# EAGLE design LeguinoNano (EAGLE 8.5.0)
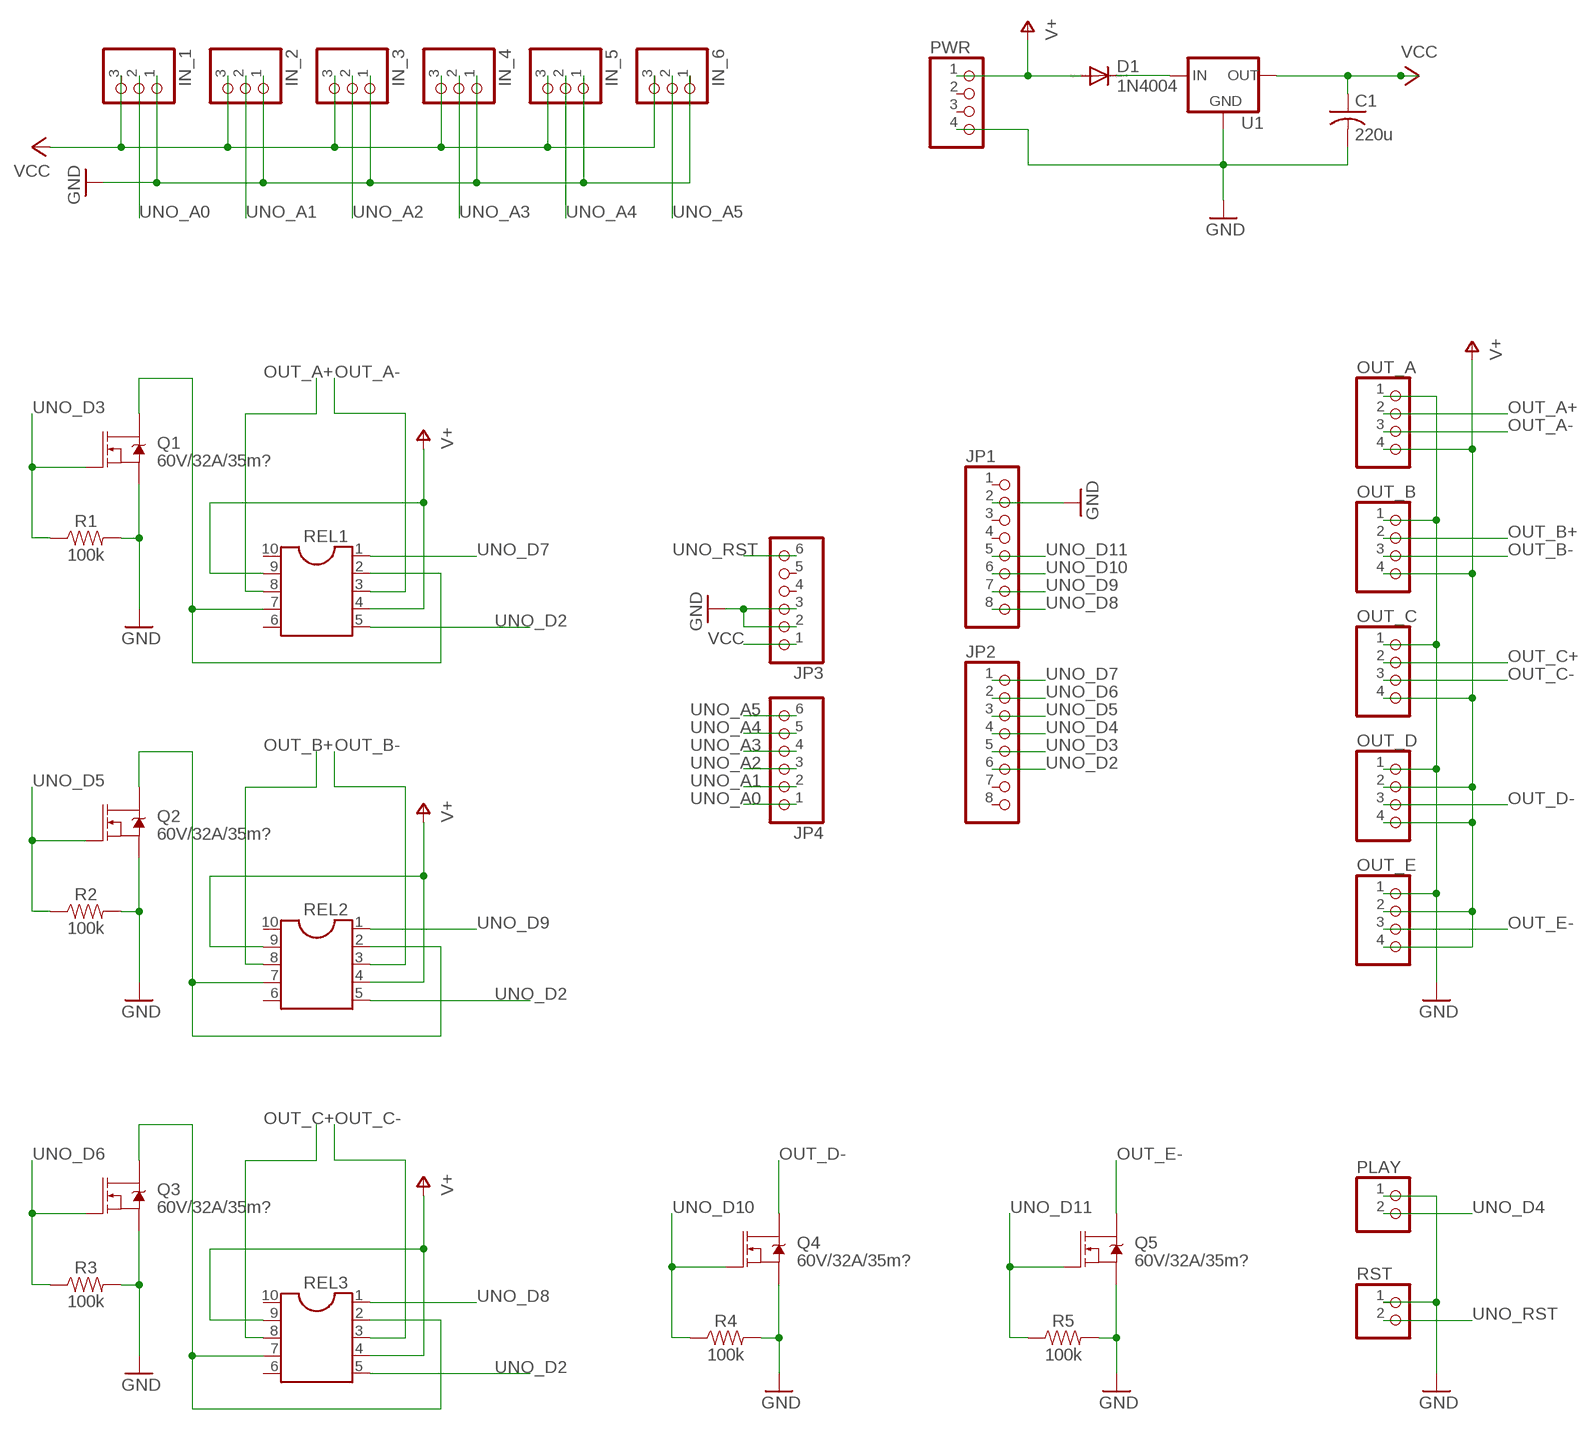
[diagram p0: schematic, sheet 1]

## Parts
C1  220u  C-US050-030X075  [C050-030X075]
D1  1N4004  [DO41-10]
IN_1  PINHD-1X3  [1X03]
IN_2  PINHD-1X3  [1X03]
IN_3  PINHD-1X3  [1X03]
IN_4  PINHD-1X3  [1X03]
IN_5  PINHD-1X3  [1X03]
IN_6  PINHD-1X3  [1X03]
JP1  PINHD-1X8  [1X08]
JP2  PINHD-1X8  [1X08]
JP3  PINHD-1X6  [1X06]
JP4  PINHD-1X6  [1X06]
OUT_A  PINHD-1X4  [1X04]
OUT_B  PINHD-1X4  [1X04]
OUT_C  PINHD-1X4  [1X04]
OUT_D  PINHD-1X4  [1X04]
OUT_E  PINHD-1X4  [1X04]
PLAY  PINHD-1X2  [1X02]
PWR  PINHD-1X4  [1X04]
Q1  60V/32A/35m?  MOSFET-NCH-FQP30N06L  [TO220V]
Q2  60V/32A/35m?  MOSFET-NCH-FQP30N06L  [TO220V]
Q3  60V/32A/35m?  MOSFET-NCH-FQP30N06L  [TO220V]
Q4  60V/32A/35m?  MOSFET-NCH-FQP30N06L  [TO220V]
Q5  60V/32A/35m?  MOSFET-NCH-FQP30N06L  [TO220V]
R1  100k  100KOHM-HORIZ-1/4W-1%  [AXIAL-0.3]
R2  100k  100KOHM-HORIZ-1/4W-1%  [AXIAL-0.3]
R3  100k  100KOHM-HORIZ-1/4W-1%  [AXIAL-0.3]
R4  100k  100KOHM-HORIZ-1/4W-1%  [AXIAL-0.3]
R5  100k  100KOHM-HORIZ-1/4W-1%  [AXIAL-0.3]
REL1  DIL10  [DIL10]
REL2  DIL10  [DIL10]
REL3  DIL10  [DIL10]
RST  PINHD-1X2  [1X02]
U1  V_REG_78XX-TO-220  [TO-220-ALT]

## Nets
GND [supply]: C1.2 IN_1.1 IN_2.1 IN_3.1 IN_4.1 IN_5.1 IN_6.1 JP1.2 JP3.2 JP3.3 OUT_A.1 OUT_B.1 OUT_C.1 OUT_D.1 OUT_E.1 PLAY.1 PWR.4 Q1.3(S) Q2.3(S) Q3.3(S) Q4.3(S) Q5.3(S) R1.P$2 R2.P$2 R3.P$2 R4.P$2 R5.P$2 RST.1 U1.GND
N$1: D1.C U1.IN
N$4 [supply]: Q1.2(D) REL1.2 REL1.7
N$13 [supply]: Q2.2(D) REL2.2 REL2.7
N$19 [supply]: Q3.2(D) REL3.2 REL3.7
OUT_A+ [supply]: OUT_A.2 REL1.8
OUT_A- [supply]: OUT_A.3 REL1.3
OUT_B+ [supply]: OUT_B.2 REL2.8
OUT_B- [supply]: OUT_B.3 REL2.3
OUT_C+ [supply]: OUT_C.2 REL3.8
OUT_C- [supply]: OUT_C.3 REL3.3
OUT_D- [supply]: OUT_D.3 Q4.2(D)
OUT_E- [supply]: OUT_E.3 Q5.2(D)
UNO_A0: IN_1.2 JP4.1
UNO_A1: IN_2.2 JP4.2
UNO_A2: IN_3.2 JP4.3
UNO_A3: IN_4.2 JP4.4
UNO_A4: IN_5.2 JP4.5
UNO_A5: IN_6.2 JP4.6
UNO_D2: JP2.6 REL1.5 REL2.5 REL3.5
UNO_D3: JP2.5 Q1.1(G) R1.P$1
UNO_D4: JP2.4 PLAY.2
UNO_D5: JP2.3 Q2.1(G) R2.P$1
UNO_D6: JP2.2 Q3.1(G) R3.P$1
UNO_D7: JP2.1 REL1.1
UNO_D8: JP1.8 REL3.1
UNO_D9: JP1.7 REL2.1
UNO_D10: JP1.6 Q4.1(G) R4.P$1
UNO_D11: JP1.5 Q5.1(G) R5.P$1
UNO_RST: JP3.6 RST.2
V+ [supply]: D1.A OUT_A.4 OUT_B.4 OUT_C.4 OUT_D.2 OUT_D.4 OUT_E.2 OUT_E.4 PWR.1 REL1.4 REL1.9 REL2.4 REL2.9 REL3.4 REL3.9
VCC: C1.1 IN_1.3 IN_2.3 IN_3.3 IN_4.3 IN_5.3 IN_6.3 JP3.1 U1.OUT
Unconnected: JP1.1 JP1.3 JP1.4 JP2.7 JP2.8 JP3.4 JP3.5 PWR.2 PWR.3 REL1.6 REL1.10 REL2.6 REL2.10 REL3.6 REL3.10

## Library data of the parts
C1 = adafruit:C-US: CAPACITOR, American symbol
D1 = diode:1N4004: DIODE general purpose rectifier, 1 A
IN_1-IN_6 = pinhead:PINHD-1X3: PIN HEADER
JP1 JP2 = pinhead:PINHD-1X8: PIN HEADER
JP3 JP4 = pinhead:PINHD-1X6: PIN HEADER
OUT_A OUT_B OUT_C OUT_D OUT_E PWR = pinhead:PINHD-1X4: PIN HEADER
PLAY RST = pinhead:PINHD-1X2: PIN HEADER
Q1-Q5 = SparkFun-DiscreteSemi:MOSFET-NCH: N-channel MOSFETs Voltage controlled devices that allow control of high current outputs. SparkFun Products: SparkFun OpenScale <https://www.sparkfun.com/products/13261> SparkFun Digital Sandbox <https://www.sparkfun.com/products/12651> SparkFun Monster Moto Shield <https://www.sparkfun.com/products/10182> SparkFun MOSFET Power Controller <https://www.sparkfun.com/products/11214>; PROD_ID: TRANS-10060
R1-R5 = SparkFun-Resistors:100KOHM: 100k? resistor A resistor is a passive two-terminal electrical component that implements electrical resistance as a circuit element. Resistors act to reduce current flow, and, at the same time, act to lower voltage levels within circuits. - Wikipedia; PROD_ID: RES-12184
REL1-REL3 = ic-package:DIL10: Dual In Line / Socket
U1 = SparkFun-IC-Power:V_REG_78XX: Voltage Regulator Standard 78xx regulator. IGO (Input Ground Output). Spark Fun Electronics SKU : COM-00107; PROD_ID: VREG-08450; SF_ID: COM-00107

## Net classes
0 default: width 0.254 mm, drill 0.254 mm, clearance 0.254 mm
1 supply: width 1.016 mm, drill 1.016 mm, clearance 0.254 mm

## Board
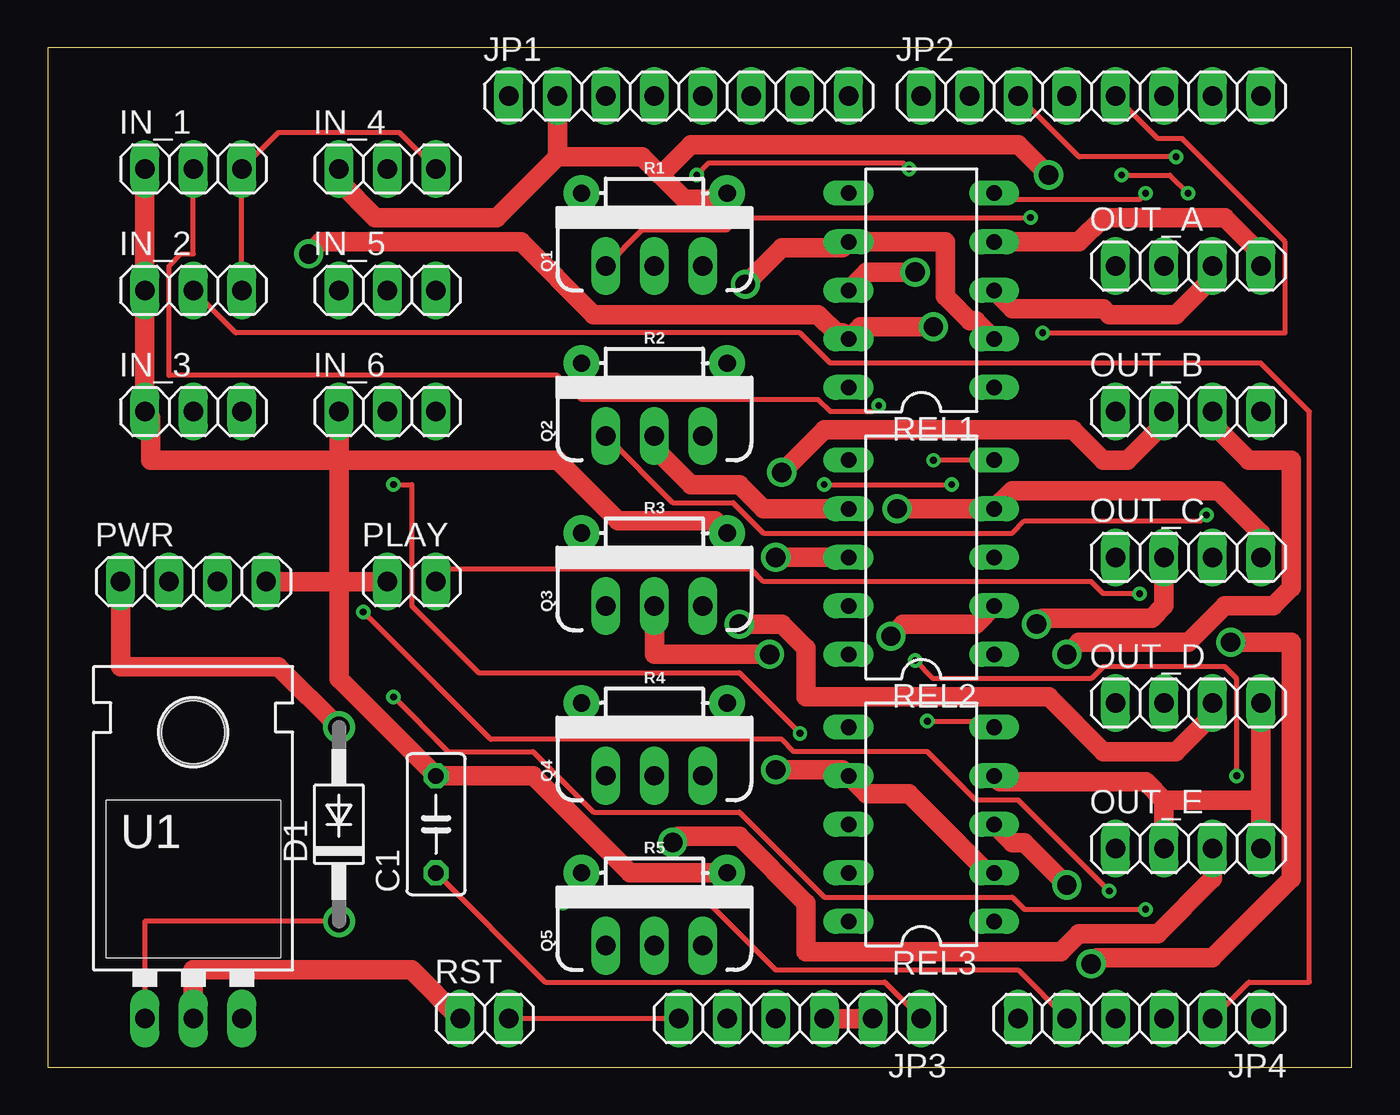
[diagram p1: board, top side]
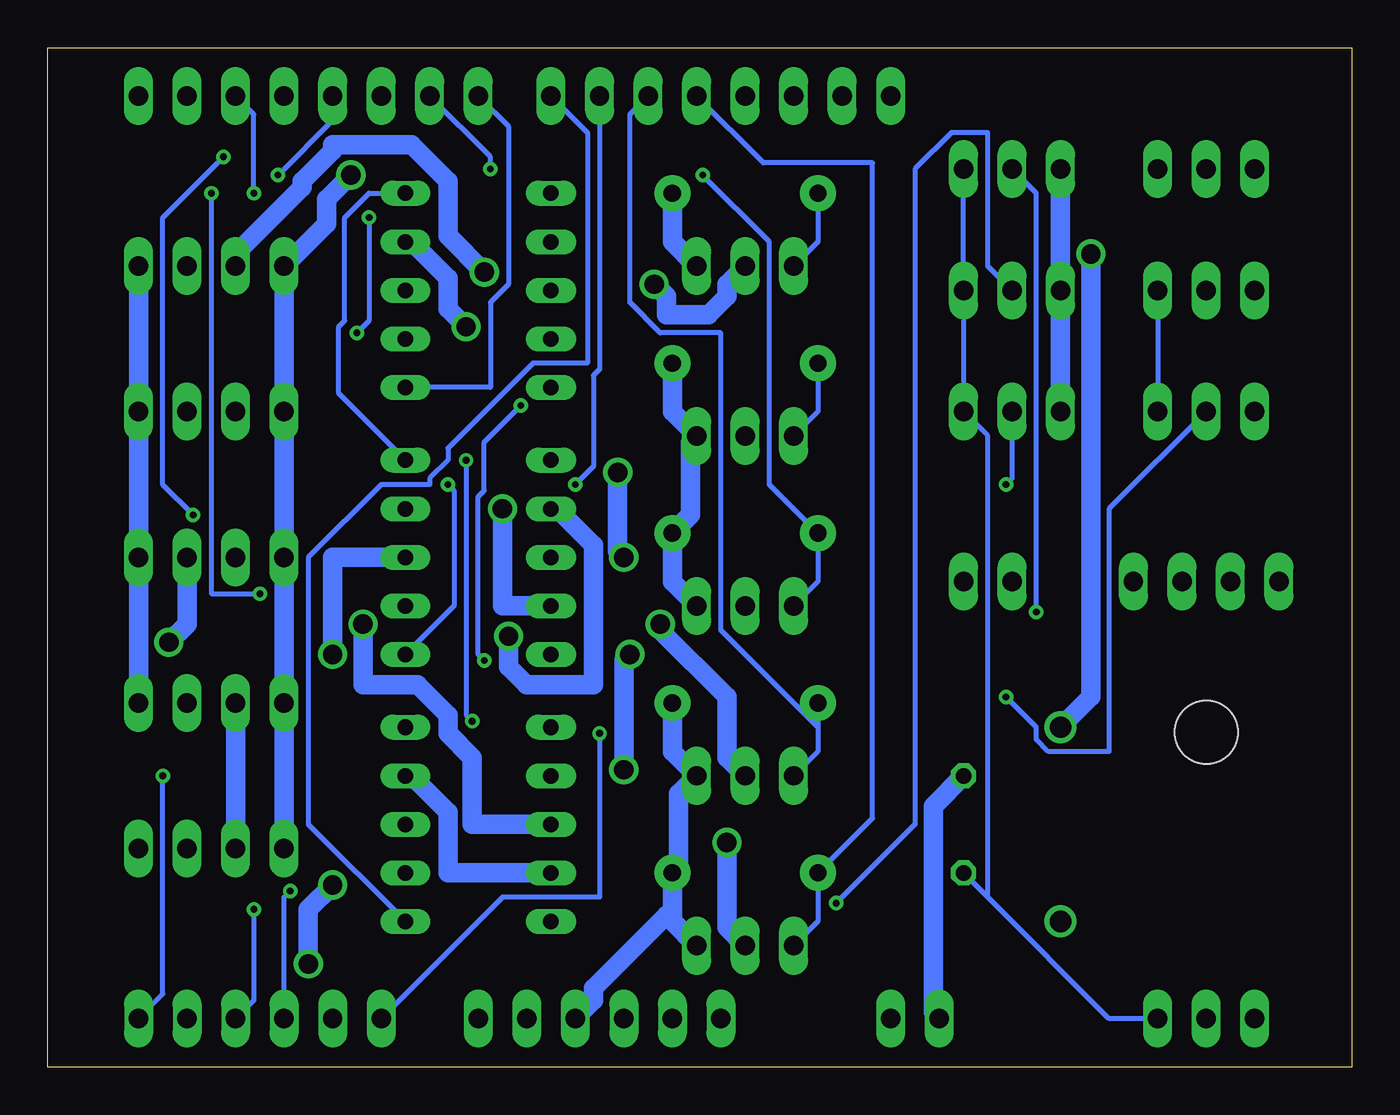
[diagram p2: board, bottom side, seen from below]

Size 68.25 x 53.33 mm. Coordinates in mm from the lower left corner, seen from the top.
Outline: 0,0 68.25,0 68.25,53.33 0,53.33 0,0
Copper layers (1*16): Top 0.035mm / dielectric 1.5mm / Bottom 0.035mm
Design rules "default *": minimum track width 10mil, minimum drill 0.35mm, track to track 10mil, track to pad 10mil, pad to pad 10mil, via to via 10mil, smd to smd 6mil, copper to edge 40mil, drill to drill 40mil, minimum pad ring 10mil, minimum via ring 8mil, stop-mask expansion 4mil, vias tented up to drill 0mil, thermal gap 10mil

### Footprints (pad centres in the part's own frame; a part is rotated, then mirrored left to right if it is on the bottom)
C050-030X075 = drill 0.813 octagon: 1 -2.54,0; 2 2.54,0
DO41-10 = drill 1.118: A 5.08,0; C -5.08,0
1X03 = drill 1.016 long: 1 -2.54,0; 2 0,0; 3 2.54,0
1X08 = drill 1.016 long: 1 -8.89,0; 2 -6.35,0; 3 -3.81,0; 4 -1.27,0; 5 1.27,0; 6 3.81,0; 7 6.35,0; 8 8.89,0
1X06 = drill 1.016 long: 1 -6.35,0; 2 -3.81,0; 3 -1.27,0; 4 1.27,0; 5 3.81,0; 6 6.35,0
1X04 = drill 1.016 long: 1 -3.81,0; 2 -1.27,0; 3 1.27,0; 4 3.81,0
1X02 = drill 1.016 long: 1 -1.27,0; 2 1.27,0
TO220V = drill 1.016 long: 1 -2.54,0; 2 0,0; 3 2.54,0
AXIAL-0.3 = drill 0.9 pad 1.88: P$1 -3.81,0; P$2 3.81,0
DIL10 = drill 0.813 long: 1 -5.08,-3.81; 2 -2.54,-3.81; 3 0,-3.81; 4 2.54,-3.81; 5 5.08,-3.81; 6 5.08,3.81; 7 2.54,3.81; 8 0,3.81; 9 -2.54,3.81; 10 -5.08,3.81
TO-220-ALT = drill 1.016 long: GND 0,-3.81; IN -2.54,-3.81; OUT 2.54,-3.81 | hole 3.302: 0,11.176

### Placement (x,y rotation side)
C1  20.32,12.7 90 top
D1  15.24,12.7 90 top
IN_1  7.62,46.99 0 top
IN_2  7.62,40.64 0 top
IN_3  7.62,34.29 0 top
IN_4  17.78,46.99 0 top
IN_5  17.78,40.64 0 top
IN_6  17.78,34.29 0 top
JP1  33.02,50.8 0 top
JP2  54.61,50.8 0 top
JP3  39.37,2.54 180 top
JP4  57.15,2.54 180 top
OUT_A  59.69,41.91 0 top
OUT_B  59.69,34.29 0 top
OUT_C  59.69,26.67 0 top
OUT_D  59.69,19.05 0 top
OUT_E  59.69,11.43 0 top
PLAY  19.05,25.4 0 top
PWR  7.62,25.4 0 top
Q1  31.75,41.91 0 top
Q2  31.75,33.02 0 top
Q3  31.75,24.13 0 top
Q4  31.75,15.24 0 top
Q5  31.75,6.35 0 top
R1  31.75,45.72 0 top
R2  31.75,36.83 0 top
R3  31.75,27.94 0 top
R4  31.75,19.05 0 top
R5  31.75,10.16 0 top
REL1  45.72,40.64 90 top
REL2  45.72,26.67 90 top
REL3  45.72,12.7 90 top
RST  22.86,2.54 0 top
U1  7.62,6.35 0 top

### Tracks (layer width: path | path; a pad name or v marks a point on that pad's centre or on a via)
GND  (via drill 1.02)
  Top 1.016: JP3.2 JP3.3 | U1.GND 7.62,5.08 19.05,5.08 RST.1 | R5.P$2 30.48,10.16 25.4,15.24 C1.2 15.24,20.32 15.24,25.4 | 26.67,47.62 JP1.2 | 26.67,47.62 31.11,47.62 32.07,46.67 | 32.07,46.67 33.34,45.4 35.24,45.4 R1.P$2 | IN_1.1 IN_2.1 IN_3.1 5.4,33.97 5.4,31.75 15.24,31.75 | PLAY.1 15.24,25.4 | 15.24,25.4 PWR.4 | IN_6.1 15.24,31.75 | 15.24,31.75 15.24,25.4 | R3.P$2 34.92,28.57 29.84,28.57 26.67,31.75 15.24,31.75 | 26.67,47.62 23.5,44.45 17.14,44.45 15.24,46.36 IN_4.1 | v52.39,46.67 50.8,48.26 33.66,48.26 32.07,46.67
  Bottom 1.016: R4.P$2 35.56,16.51 Q4.3 35.24,14.29 35.24,10.48 R5.P$2 35.56,7.62 | 35.56,7.62 Q5.3 | JP3.3 39.69,3.49 39.69,4.13 35.88,7.94 35.56,7.62 | C1.2 21.91,13.65 21.91,2.86 RST.1 | OUT_E.1 OUT_D.1 OUT_C.1 OUT_B.1 OUT_A.1 53.66,44.13 53.66,45.4 v52.39,46.67 | Q1.3 35.56,43.18 R1.P$2 | Q3.3 35.56,25.4 R3.P$2 34.61,28.89 34.61,32.7 Q2.3 35.56,34.29 R2.P$2 | IN_6.1 IN_5.1 IN_4.1
N$1
  Top 0.254: U1.IN 5.08,7.62 D1.C
N$4  (via drill 1.02)
  Top 1.016: REL1.2 48.58,39.05 48.26,39.05 46.99,40.32 46.99,43.18 REL1.7 41.59,42.86 38.42,42.86 v36.51,40.96
  Bottom 1.016: Q1.2 32.7,40.96 32.7,40.32 33.66,39.37 35.88,39.37 35.88,40.32 v36.51,40.96
N$13  (via drill 1.02)
  Top 1.016: REL2.7 37.47,29.21 36.19,30.48 33.66,30.48 31.75,32.39 Q2.2 | REL2.2 48.58,23.18 44.77,23.18 v44.13,22.54
  Bottom 1.016: v44.13,22.54 44.13,20.95 43.18,20 39.69,20 39.69,27.3 41.59,29.21 REL2.7
N$19  (via drill 1.02)
  Top 1.016: REL3.2 49.21,10.16 45.08,14.29 42.86,14.29 REL3.7 41.59,15.56 v38.1,15.56 | Q3.2 31.75,21.59 v37.78,21.59
  Bottom 1.016: v37.78,21.59 38.1,21.27 v38.1,15.56
OUT_A+  (via drill 1.02)
  Top 1.016: REL1.8 42.86,41.59 v45.4,41.59
  Bottom 1.016: v45.4,41.59 47.31,43.5 47.31,46.36 49.21,48.26 53.34,48.26 53.34,47.94 54.93,46.36 54.93,46.04 58.42,42.55 OUT_A.2
OUT_A-
  Top 1.016: REL1.3 50.48,39.69 55.25,39.69 55.56,39.37 59.05,39.37 60.96,41.28 OUT_A.3
OUT_B+  (via drill 1.02)
  Top 1.016: v38.1,26.67 REL2.8 | v38.42,31.11 40.64,33.34 53.66,33.34 55.25,31.75 56.52,31.75 58.42,33.66 OUT_B.2
  Bottom 1.016: v38.1,26.67 38.42,26.99 v38.42,31.11
OUT_B-  (via drill 1.02)
  Top 1.016: v53.34,21.59 53.97,22.22 59.69,22.22 61.59,24.13 64.14,24.13 65.09,25.08 65.09,31.75 62.86,31.75 60.96,33.66 OUT_B.3
  Bottom 1.016: REL2.3 53.34,26.67 v53.34,21.59
OUT_C+  (via drill 1.02)
  Top 1.016: v51.75,23.18 52.07,23.49 57.78,23.49 58.42,24.13 OUT_C.2
  Bottom 1.016: REL3.8 46.04,12.7 46.04,16.19 47.31,17.46 47.31,18.41 48.89,20 51.75,20 v51.75,23.18
OUT_C-  (via drill 1.02)
  Top 1.016: REL3.3 50.48,11.75 51.12,11.75 v53.34,9.52 | v54.61,5.4 54.93,5.72 60.96,5.72 65.09,9.84 65.09,22.22 v61.91,22.22
  Bottom 1.016: v53.34,9.52 54.61,8.25 v54.61,5.4 | v61.91,22.22 60.96,23.18 OUT_C.3
OUT_D-  (via drill 1.02)
  Top 1.016: v36.19,23.18 38.42,23.18 39.69,21.91 39.69,19.37 52.39,19.37 55.25,16.51 59.05,16.51 60.96,18.41 OUT_D.3
  Bottom 1.016: Q4.2 32.7,16.19 32.7,19.37 36.19,22.86 v36.19,23.18
OUT_E-  (via drill 1.02)
  Top 1.016: v32.7,11.75 33.02,12.06 36.19,12.06 39.69,8.57 39.69,6.03 53.02,6.03 53.97,6.99 58.1,6.99 60.96,9.84 OUT_E.3
  Bottom 1.016: Q5.2 32.7,7.3 v32.7,11.75
UNO_A0  (via drill 0.35)
  Top 0.254: IN_1.2 7.62,42.55 6.98,42.55 6.35,41.91 6.35,36.2 26.67,36.2 27.94,34.93 40.32,34.93 40.96,34.29 43.18,34.29 v43.5,34.61 | v45.4,21.27 46.36,20.32 54.61,20.32 55.25,20.95 61.59,20.95 62.23,20.32 v62.23,15.24
  Bottom 0.254: v43.5,34.61 45.4,32.7 45.4,30.16 45.72,29.85 45.72,21.59 v45.4,21.27 | v62.23,15.24 62.23,3.81 JP4.1
UNO_A1
  Top 0.254: IN_2.2 9.84,38.42 39.37,38.42 40.96,36.83 63.5,36.83 66.04,34.29 66.04,4.44 62.86,4.44 JP4.2
UNO_A2  (via drill 0.35)
  Top 0.254: v57.47,8.25 51.12,8.25 50.48,8.89 40.64,8.89 36.19,13.33 28.58,13.33 25.4,16.51 20.95,16.51 v18.1,19.37
  Bottom 0.254: JP4.3 57.47,3.49 v57.47,8.25 | v18.1,19.37 16.51,17.78 16.51,17.14 15.88,16.51 12.7,16.51 12.7,29.21 IN_3.2
UNO_A3  (via drill 0.35)
  Top 0.254: v16.51,23.81 23.18,17.14 38.42,17.14 39.05,16.51 46.04,16.51 48.58,13.97 50.8,13.97 v55.56,9.21
  Bottom 0.254: IN_4.2 16.51,45.72 v16.51,23.81 | v55.56,9.21 55.88,8.89 JP4.4
UNO_A4  (via drill 0.35)
  Top 0.254: JP4.5 50.8,5.08 38.1,5.08 34.61,8.57 v26.99,8.57
  Bottom 0.254: v26.99,8.57 22.86,12.7 22.86,46.99 20.95,48.9 19.05,48.9 19.05,41.91 IN_5.2
UNO_A5  (via drill 0.35)
  Top 0.254: v39.37,17.46 36.19,20.64 22.54,20.64 19.05,24.13 19.05,30.48 v18.1,30.48
  Bottom 0.254: JP4.6 44.45,8.89 39.37,8.89 v39.37,17.46 | v18.1,30.48 17.78,30.8 IN_6.2
UNO_D2  (via drill 0.35)
  Top 0.254: REL3.5 49.21,18.1 v46.04,18.1 | REL2.5 v46.36,31.75 | v57.47,45.72 57.15,45.4 49.85,45.4 REL1.5
  Bottom 0.254: v46.04,18.1 46.36,18.41 v46.36,31.75 | REL1.5 51.44,45.72 52.7,44.45 52.7,39.05 53.02,38.73 53.02,35.24 REL2.5 | JP2.6 57.47,49.85 v57.47,45.72
UNO_D3  (via drill 0.35)
  Top 0.254: JP2.5 58.1,48.58 59.37,48.58 64.77,43.18 64.77,38.42 v52.07,38.42 | v51.44,44.45 36.19,44.45 35.56,43.82 31.11,43.82 Q1.1
  Bottom 0.254: Q1.1 27.94,43.18 R1.P$1 | v52.07,38.42 51.44,39.05 v51.44,44.45
UNO_D4  (via drill 0.35)
  Top 0.254: PLAY.2 20.95,26.04 36.83,26.04 37.47,25.4 54.61,25.4 55.25,24.76 v57.15,24.76 | v59.69,45.72 58.74,46.67 v56.2,46.67
  Bottom 0.254: v57.15,24.76 59.69,24.76 v59.69,45.72 | v56.2,46.67 53.34,49.53 JP2.4
UNO_D5  (via drill 0.35)
  Top 0.254: JP2.3 53.97,47.62 v59.05,47.62 | v60.64,28.89 60.33,28.57 51.12,28.57 50.48,27.94 37.47,27.94 35.88,29.53 32.7,29.53 Q2.1
  Bottom 0.254: Q2.1 27.94,34.29 R2.P$1 | v59.05,47.62 62.23,44.45 62.23,30.48 v60.64,28.89
UNO_D6  (via drill 0.35)
  Top 0.254: v45.08,46.99 44.77,47.31 34.61,47.31 v33.97,46.67
  Bottom 0.254: Q3.1 27.94,25.4 R3.P$1 30.48,30.48 30.48,43.18 v33.97,46.67 | JP2.2 45.08,47.62 v45.08,46.99
UNO_D7
  Bottom 0.254: REL1.1 45.08,35.56 45.08,40.01 44.13,40.96 44.13,49.21 JP2.1
UNO_D8
  Bottom 0.254: REL3.1 54.61,12.7 54.61,26.67 50.8,30.48 48.26,30.48 48.26,30.8 47.31,31.75 47.31,32.39 42.86,36.83 40,36.83 40,48.9 JP1.8
UNO_D9  (via drill 0.35)
  Top 0.254: v40.64,30.48 v47.31,30.48
  Bottom 0.254: REL2.1 46.99,24.13 46.99,30.16 v47.31,30.48 | v40.64,30.48 39.69,31.43 39.69,36.2 39.37,36.51 JP1.7
UNO_D10
  Bottom 0.254: Q4.1 27.94,16.51 27.94,17.78 | R4.P$1 27.94,17.78 | JP1.6 37.78,49.85 37.78,40.01 36.19,38.42 33.02,38.42 33.02,22.86 27.94,17.78
UNO_D11
  Bottom 0.254: Q5.1 27.94,7.62 R5.P$1 25.08,13.02 25.08,47.31 30.8,47.31 JP1.5
UNO_RST
  Top 0.254: JP3.6 RST.2
V+  (via drill 1.02)
  Top 1.016: OUT_D.4 63.5,13.97 | 63.5,13.97 OUT_E.4 | 58.42,13.97 OUT_E.2 | 63.5,13.97 58.42,13.97 | REL3.4 49.85,14.92 57.47,14.92 58.42,13.97 | PWR.1 3.81,20.95 12.06,20.95 D1.A | v46.36,38.73 42.55,38.73 REL1.9 41.59,38.42 41.28,38.42 40.32,39.37 28.58,39.37 24.77,43.18 14.29,43.18 v13.65,42.55 | v44.45,29.21 REL2.4 50.48,30.16 61.28,30.16 63.5,27.94 OUT_C.4 | REL1.4 53.97,43.18 55.25,44.45 61.59,44.45 63.5,42.55 OUT_A.4
  Bottom 1.016: REL3.9 47.31,10.16 47.31,13.33 49.21,15.24 REL3.4 | OUT_D.2 OUT_E.2 | v46.36,38.73 47.31,39.69 47.31,41.28 49.21,43.18 REL1.4 | REL2.9 44.45,24.13 v44.45,29.21 | OUT_A.4 OUT_B.4 OUT_C.4 OUT_D.4 | D1.A 13.65,19.37 v13.65,42.55
VCC
  Top 0.254: IN_2.3 IN_1.3 12.06,48.9 18.41,48.9 IN_4.3 | JP3.1 43.81,4.44 26.03,4.44 C1.1
  Bottom 0.254: IN_2.3 IN_3.3 | IN_4.3 IN_5.3 IN_6.3 19.05,33.02 19.05,8.89 | 19.05,8.89 12.7,2.54 U1.OUT | 19.05,8.89 C1.1